# Altium project M3 ICE.PrjPcb
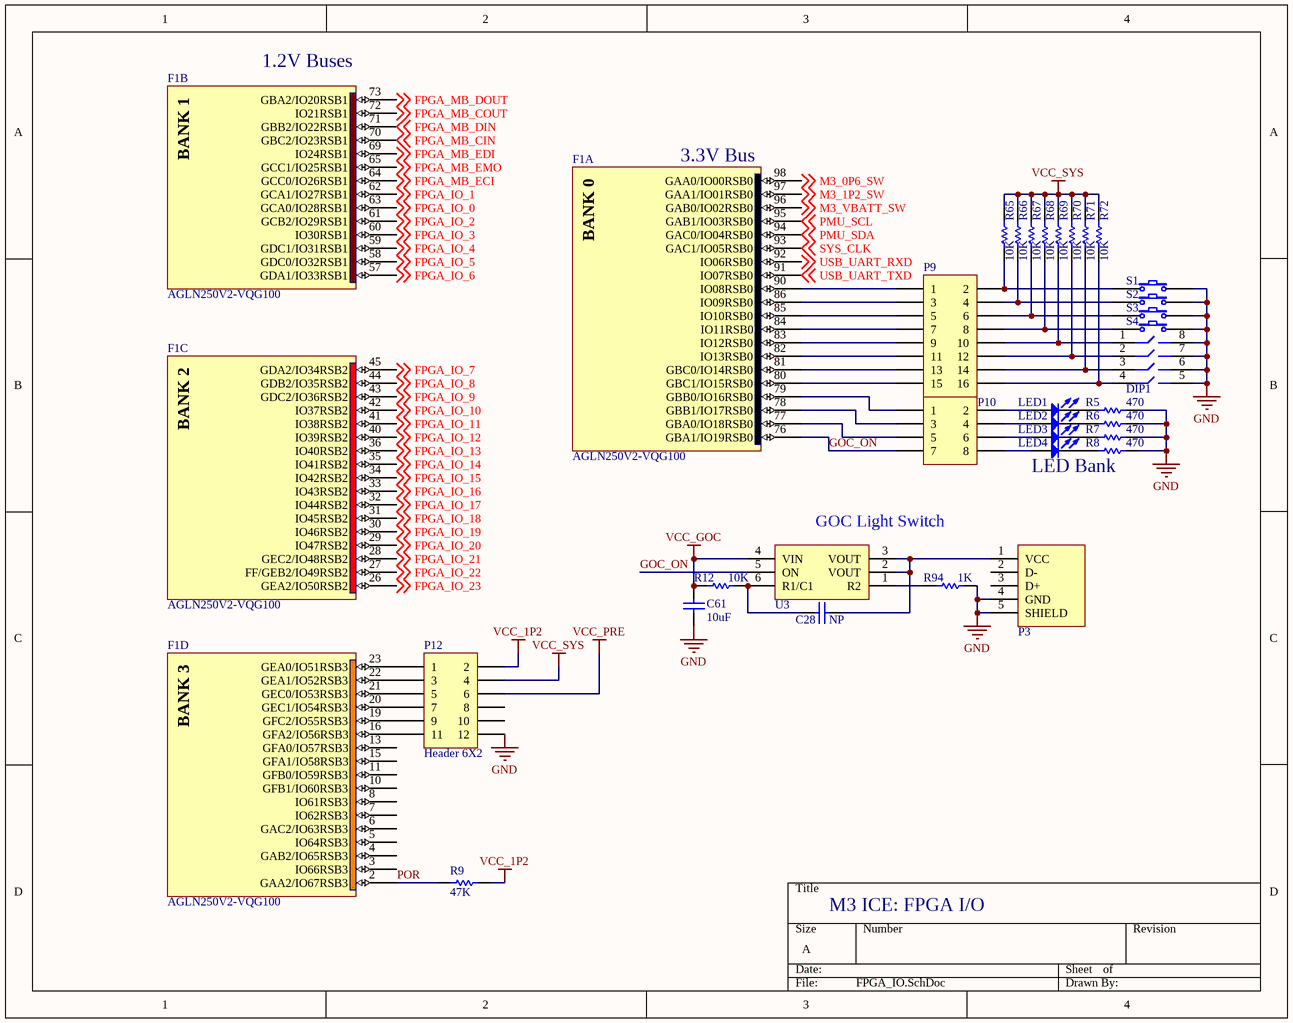
[diagram p0: FPGA_IO.SchDoc]
5 sheets, 223 parts. Net scope: global (net labels, ports and power ports of the same name join across sheets).
Board file: M3 ICE.PcbDoc
Sheets:
  FPGA_IO.SchDoc
  Power.SchDoc
  FPGA_misc.SchDoc
  USB_to_UART.SchDoc
  M3_Chip.SchDoc

## Sheet FPGA_IO.SchDoc
size A

### Parts
C28  value NP  [0402]  (hidden comment: Cap Semi)
C61  value 10uF  [0805]  (hidden comment: Cap Chip)
DIP1  ADE0404  [DIP-8]  (value not drawn)
F1  AGLN250V2-VQG100  [VQ100_N]  (parts A,B,C,D of 8)
LED1  LED 1206  [1206_LED]  (value not drawn)
LED2  LED 1206  [1206_LED]  (value not drawn)
LED3  LED 1206  [1206_LED]  (value not drawn)
LED4  LED 1206  [1206_LED]  (value not drawn)
P3  USB_HORIZONTAL  [USB_HORIZONTAL]  (value not drawn)
P9  Header 8X2  [HDR2X8]  (value not drawn)
P10  Header 4X2  [HDR2X4]  (value not drawn)
P12  Header 6X2  [HDR2X6]
R5  value 470  [0603]  (hidden comment: Res Chip)
R6  value 470  [0603]  (hidden comment: Res Chip)
R7  value 470  [0603]  (hidden comment: Res Chip)
R8  value 470  [0603]  (hidden comment: Res Chip)
R9  value 47K  [0603]  (hidden comment: Res Chip)
R12  value 10K  [0402]  (hidden comment: Res Chip)
R65  value 10K  [0603]  (hidden comment: Res Chip)
R66  value 10K  [0603]  (hidden comment: Res Chip)
R67  value 10K  [0603]  (hidden comment: Res Chip)
R68  value 10K  [0603]  (hidden comment: Res Chip)
R69  value 10K  [0603]  (hidden comment: Res Chip)
R70  value 10K  [0603]  (hidden comment: Res Chip)
R71  value 10K  [0603]  (hidden comment: Res Chip)
R72  value 10K  [0603]  (hidden comment: Res Chip)
R94  value 1K  [0402]  (hidden comment: Res Chip)
S1  EVQ-PAE04M  [EVQPA]  (value not drawn)
S2  EVQ-PAE04M  [EVQPA]  (value not drawn)
S3  EVQ-PAE04M  [EVQPA]  (value not drawn)
S4  EVQ-PAE04M  [EVQPA]  (value not drawn)
U3  FDC6330L  [SUPERSOT-6]  (value not drawn)

### Nets
GND: C61.2 DIP1.5 DIP1.6 DIP1.7 DIP1.8 P3.4(GND) P3.5(SHIELD) P12.12 R5.1 R6.1 R7.1 R8.1 R94.2 S1.2 S2.2 S3.2 S4.2
VCC_1P2: P12.2 R9.2
VCC_GOC: C61.1 R12.1 U3.4(VIN)
VCC_PRE: P12.6
VCC_SYS: P12.4 R65.1 R66.1 R67.1 R68.1 R69.1 R70.1 R71.1 R72.1  [project net VCC_B0]
FPGA_IO_0: F1.63(GCA0/IO28RSB1) ; off-sheet FPGA_IO_0
FPGA_IO_1: F1.62(GCA1/IO27RSB1) ; off-sheet FPGA_IO_1
FPGA_IO_2: F1.61(GCB2/IO29RSB1) ; off-sheet FPGA_IO_2
FPGA_IO_3: F1.60(IO30RSB1) ; off-sheet FPGA_IO_3
FPGA_IO_4: F1.59(GDC1/IO31RSB1) ; off-sheet FPGA_IO_4
FPGA_IO_5: F1.58(GDC0/IO32RSB1) ; off-sheet FPGA_IO_5
FPGA_IO_6: F1.57(GDA1/IO33RSB1) ; off-sheet FPGA_IO_6
FPGA_IO_7: F1.45(GDA2/IO34RSB2) ; off-sheet FPGA_IO_7
FPGA_IO_8: F1.44(GDB2/IO35RSB2) ; off-sheet FPGA_IO_8
FPGA_IO_9: F1.43(GDC2/IO36RSB2) ; off-sheet FPGA_IO_9
FPGA_IO_10: F1.42(IO37RSB2) ; off-sheet FPGA_IO_10
FPGA_IO_11: F1.41(IO38RSB2) ; off-sheet FPGA_IO_11
FPGA_IO_12: F1.40(IO39RSB2) ; off-sheet FPGA_IO_12
FPGA_IO_13: F1.36(IO40RSB2) ; off-sheet FPGA_IO_13
FPGA_IO_14: F1.35(IO41RSB2) ; off-sheet FPGA_IO_14
FPGA_IO_15: F1.34(IO42RSB2) ; off-sheet FPGA_IO_15
FPGA_IO_16: F1.33(IO43RSB2) ; off-sheet FPGA_IO_16
FPGA_IO_17: F1.32(IO44RSB2) ; off-sheet FPGA_IO_17
FPGA_IO_18: F1.31(IO45RSB2) ; off-sheet FPGA_IO_18
FPGA_IO_19: F1.30(IO46RSB2) ; off-sheet FPGA_IO_19
FPGA_IO_20: F1.29(IO47RSB2) ; off-sheet FPGA_IO_20
FPGA_IO_21: F1.28(GEC2/IO48RSB2) ; off-sheet FPGA_IO_21
FPGA_IO_22: F1.27(FF/GEB2/IO49RSB2) ; off-sheet FPGA_IO_22
FPGA_IO_23: F1.26(GEA2/IO50RSB2) ; off-sheet FPGA_IO_23
FPGA_MB_CIN: F1.70(GBC2/IO23RSB1) ; off-sheet FPGA_MB_CIN
FPGA_MB_COUT: F1.72(IO21RSB1) ; off-sheet FPGA_MB_COUT
FPGA_MB_DIN: F1.71(GBB2/IO22RSB1) ; off-sheet FPGA_MB_DIN
FPGA_MB_DOUT: F1.73(GBA2/IO20RSB1) ; off-sheet FPGA_MB_DOUT
FPGA_MB_ECI: F1.64(GCC0/IO26RSB1) ; off-sheet FPGA_MB_ECI
FPGA_MB_EDI: F1.69(IO24RSB1) ; off-sheet FPGA_MB_EDI
FPGA_MB_EMO: F1.65(GCC1/IO25RSB1) ; off-sheet FPGA_MB_EMO
GOC_ON: F1.76(GBA1/IO19RSB0) P10.7 U3.5(ON)
M3_0P6_SW: F1.98(GAA0/IO00RSB0) ; off-sheet M3_0P6_SW
M3_1P2_SW: F1.97(GAA1/IO01RSB0) ; off-sheet M3_1P2_SW
M3_VBATT_SW: F1.96(GAB0/IO02RSB0) ; off-sheet M3_VBATT_SW
PMU_SCL: F1.95(GAB1/IO03RSB0) ; off-sheet PMU_SCL
PMU_SDA: F1.94(GAC0/IO04RSB0) ; off-sheet PMU_SDA
POR: F1.2(GAA2/IO67RSB3) R9.1
SYS_CLK: F1.93(GAC1/IO05RSB0) ; off-sheet SYS_CLK
USB_UART_RXD: F1.92(IO06RSB0) ; off-sheet USB_UART_RXD
USB_UART_TXD: F1.91(IO07RSB0) ; off-sheet USB_UART_TXD
NetC28_1: C28.1 P3.1(VCC) U3.2(VOUT) U3.3(VOUT)
NetC28_2: C28.2 R12.2 U3.6(R1/C1)
NetDIP1_1: DIP1.1 P9.10 R69.2
NetDIP1_2: DIP1.2 P9.12 R70.2
NetDIP1_3: DIP1.3 P9.14 R71.2
NetDIP1_4: DIP1.4 P9.16 R72.2
NetF1_16: F1.16(GFA2/IO56RSB3) P12.11
NetF1_19: F1.19(GFC2/IO55RSB3) P12.9
NetF1_20: F1.20(GEC1/IO54RSB3) P12.7
NetF1_21: F1.21(GEC0/IO53RSB3) P12.5
NetF1_22: F1.22(GEA1/IO52RSB3) P12.3
NetF1_23: F1.23(GEA0/IO51RSB3) P12.1
NetF1_77: F1.77(GBA0/IO18RSB0) P10.5
NetF1_78: F1.78(GBB1/IO17RSB0) P10.3
NetF1_79: F1.79(GBB0/IO16RSB0) P10.1
NetF1_80: F1.80(GBC1/IO15RSB0) P9.15
NetF1_81: F1.81(GBC0/IO14RSB0) P9.13
NetF1_82: F1.82(IO13RSB0) P9.11
NetF1_83: F1.83(IO12RSB0) P9.9
NetF1_84: F1.84(IO11RSB0) P9.7
NetF1_85: F1.85(IO10RSB0) P9.5
NetF1_86: F1.86(IO09RSB0) P9.3
NetF1_90: F1.90(IO08RSB0) P9.1
NetLED1_1: LED1.1(A) P10.2
NetLED1_2: LED1.2(K) R5.2
NetLED2_1: LED2.1(A) P10.4
NetLED2_2: LED2.2(K) R6.2
NetLED3_1: LED3.1(A) P10.6
NetLED3_2: LED3.2(K) R7.2
NetLED4_1: LED4.1(A) P10.8
NetLED4_2: LED4.2(K) R8.2
NetP9_2: P9.2 R65.2 S1.1
NetP9_4: P9.4 R66.2 S2.1
NetP9_6: P9.6 R67.2 S3.1
NetP9_8: P9.8 R68.2 S4.1
NetR94_1: R94.1 U3.1(R2)

Not connected (* = marked no-connect by the designer): F1 3(IO66RSB3) 4(GAB2/IO65RSB3) 5(IO64RSB3) 6(GAC2/IO63RSB3) 7(IO62RSB3) 8(IO61RSB3) 10(GFB1/IO60RSB3) 11(GFB0/IO59RSB3) 13(GFA0/IO57RSB3) 15(GFA1/IO58RSB3); P3 2(D-) 3(D+); P12 8 10

### Notes on the sheet
- (near F1) 1.2V Buses
- (near F1) 3.3V Bus
- LED Bank
- (near U3) GOC Light Switch
- M3 ICE: FPGA I/O
- (in symbol AGLN250V2-VQG100, part A) BANK 0
- (in symbol AGLN250V2-VQG100, part B) BANK 1
- (in symbol AGLN250V2-VQG100, part C) BANK 2
- (in symbol AGLN250V2-VQG100, part D) BANK 3

### Library data of the parts
C28 = Cap Semi: Capacitor (Semiconductor SIM Model); Published: 8-Jun-2000; LatestRevisionDate: 29-May-2009; LatestRevisionNote: IPC-7351 Footprint Added.; PackageReference: C1206; Publisher: Altium Limited; PackageDescription: Chip Capacitor
C61 = Cap Chip: Capacitor (Semiconductor SIM Model); DistPartNo: 445-6857-1-ND; ManPartNo: C2012X7R1A106K; Published: 8-Jun-2000; LatestRevisionDate: 29-May-2009; LatestRevisionNote: IPC-7351 Footprint Added.; PackageReference: C1206; Publisher: Altium Limited; PackageDescription: Chip Capacitor
DIP1 = ADE0404: 4-DIP Switch; DistPartNo: 450-1364-ND; PackageReference: DIP-8; ManPartNo: ADE0404
F1 = AGLN250V2-VQG100: IGLOO nano Low-Power Flash 1.2 to 1.5V FPGA with Flash*Freeze, 68 User IOs, 250K System Gates, 1Kbit Flash ROM, 100-Pin TQFP, Commercial Grade, Pb-Free; DistPartNo: 1100-1134-ND; Published: 29-May-2009; DatasheetVersion: Feb-2009; PackageVersion: v11.0, Feb-2009; PackageReference: VQ100; Publisher: Altium Limited; PackageDescription: 100-Pin Plastic Quad Flat Pack (VQ100); Code_JEDEC: MS-026-AED; ComponentLink1Description: Manufacturer Link; ComponentLink1URL: http://www.actel.com/products/igloonano/default.aspx; ComponentLink2Description: Datasheet; ComponentLink2URL: http://www.actel.com/documents/IGLOO_nano_DS.pdf; ManPartNo: AGLN250V2-VQG100
LED1-LED4 = LED 1206: DistPartNo: 160-1169-1-ND; ManPartNo: LTST-C150GKT
P3 = USB_HORIZONTAL: DistPartNo: A31726-ND; ManPartNo: 292303-1
P9 = Header 8X2: Header, 8-Pin, Dual row; LatestRevisionDate: 17-Jul-2002; LatestRevisionNote: Re-released for DXP Platform.; Publisher: Altium Limited
P10 = Header 4X2: Header, 4-Pin, Dual row; LatestRevisionDate: 17-Jul-2002; LatestRevisionNote: Re-released for DXP Platform.; Publisher: Altium Limited
P12 = Header 6X2: Header, 6-Pin, Dual row; LatestRevisionDate: 17-Jul-2002; LatestRevisionNote: Re-released for DXP Platform.; Publisher: Altium Limited
R5-R8 = Res Chip: Semiconductor Resistor; DistPartNo: P470GCT-ND; ManPartNo: ERJ-3GEYJ471V; Published: 8-Jun-2000; LatestRevisionDate: 17-Jul-2002; LatestRevisionNote: Re-released for DXP Platform.; PackageReference: AXIAL-0.5; Publisher: Altium Limited; PackageDescription: Axial Device, Thru-Hole; 2 Leads; 0.5 in Pin Spacing
R9 = Res Chip: Semiconductor Resistor; DistPartNo: P47KGCT-ND; ManPartNo: ERJ-3GEYJ103V; Published: 8-Jun-2000; LatestRevisionDate: 17-Jul-2002; LatestRevisionNote: Re-released for DXP Platform.; PackageReference: AXIAL-0.5; Publisher: Altium Limited; PackageDescription: Axial Device, Thru-Hole; 2 Leads; 0.5 in Pin Spacing
R12 = Res Chip: Semiconductor Resistor; ManPartNo: ERJ-2RKF1002X; DistPartNo: P10.0KLCT-ND; Published: 8-Jun-2000; LatestRevisionDate: 17-Jul-2002; LatestRevisionNote: Re-released for DXP Platform.; PackageReference: AXIAL-0.5; Publisher: Altium Limited; PackageDescription: Axial Device, Thru-Hole; 2 Leads; 0.5 in Pin Spacing
R65-R72 = Res Chip: Semiconductor Resistor; DistPartNo: P10KGCT-ND; ManPartNo: ERJ-3GEYJ103V; Published: 8-Jun-2000; LatestRevisionDate: 17-Jul-2002; LatestRevisionNote: Re-released for DXP Platform.; PackageReference: AXIAL-0.5; Publisher: Altium Limited; PackageDescription: Axial Device, Thru-Hole; 2 Leads; 0.5 in Pin Spacing
R94 = Res Chip: Semiconductor Resistor; ManPartNo: ERJ-2RKF1001X; DistPartNo: P1.00KLCT-ND; Published: 8-Jun-2000; LatestRevisionDate: 17-Jul-2002; LatestRevisionNote: Re-released for DXP Platform.; PackageReference: AXIAL-0.5; Publisher: Altium Limited; PackageDescription: Axial Device, Thru-Hole; 2 Leads; 0.5 in Pin Spacing
S1-S4 = EVQ-PAE04M: Switch Push; DistPartNo: P8008S-ND; ManPartNo: EVQ-PAE04M
U3 = FDC6330L: HS Switch; DistPartNo: FDC6330LCT-ND; ManPartNo: FDC6330L

## Sheet Power.SchDoc
size A
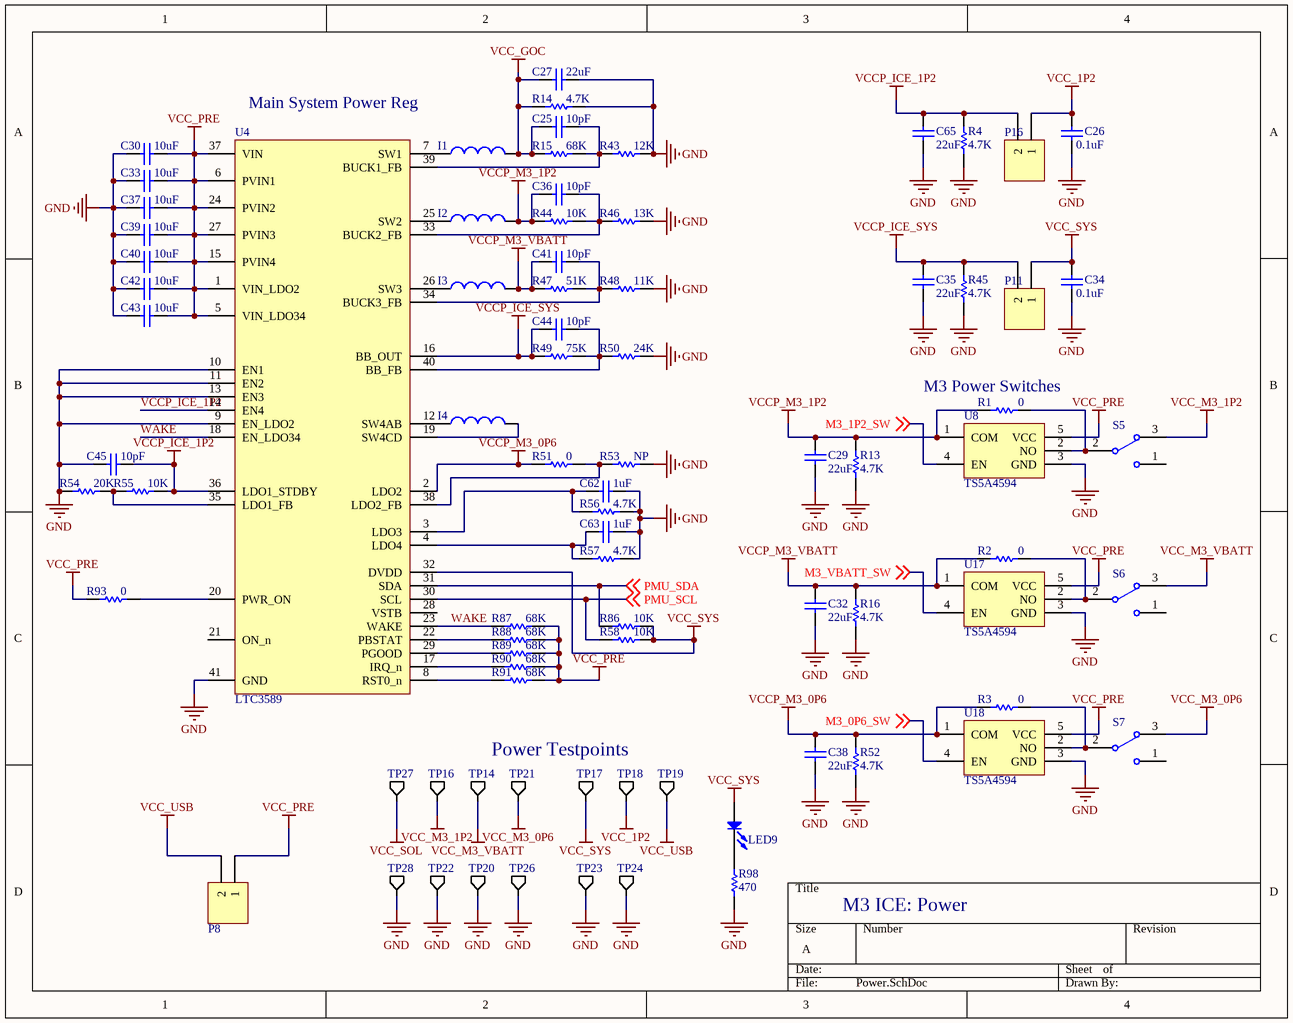
[diagram p1: Power.SchDoc]

### Parts
C25  value 10pF  [0402]  (hidden comment: Cap Semi)
C26  value 0.1uF  [1608[0603]]  (hidden comment: Cap Semi)
C27  value 22uF  [0805]  (hidden comment: Cap Chip)
C29  value 22uF  [0805]  (hidden comment: Cap Chip)
C30  value 10uF  [0805]  (hidden comment: Cap Chip)
C32  value 22uF  [0805]  (hidden comment: Cap Chip)
C33  value 10uF  [0805]  (hidden comment: Cap Chip)
C34  value 0.1uF  [1608[0603]]  (hidden comment: Cap Semi)
C35  value 22uF  [0805]  (hidden comment: Cap Chip)
C36  value 10pF  [0402]  (hidden comment: Cap Semi)
C37  value 10uF  [0805]  (hidden comment: Cap Chip)
C38  value 22uF  [0805]  (hidden comment: Cap Chip)
C39  value 10uF  [0805]  (hidden comment: Cap Chip)
C40  value 10uF  [0805]  (hidden comment: Cap Chip)
C41  value 10pF  [0402]  (hidden comment: Cap Semi)
C42  value 10uF  [0805]  (hidden comment: Cap Chip)
C43  value 10uF  [0805]  (hidden comment: Cap Chip)
C44  value 10pF  [0402]  (hidden comment: Cap Semi)
C45  value 10pF  [0402]  (hidden comment: Cap Semi)
C62  value 1uF  [0402]  (hidden comment: Cap Semi)
C63  value 1uF  [0402]  (hidden comment: Cap Semi)
C65  value 22uF  [0805]  (hidden comment: Cap Chip)
I1  NR5040T1R5N  [INDUCTOR_.118x.142mm]  (value not drawn)
I2  NR5040T1R5N  [INDUCTOR_.118x.142mm]  (value not drawn)
I3  NR5040T1R5N  [INDUCTOR_.118x.142mm]  (value not drawn)
I4  NR5040T1R5N  [INDUCTOR_.118x.142mm]  (value not drawn)
LED9  LED 1206  [1206_LED]  (value not drawn)
P8  Header 2  [HDR1X2]  (value not drawn)
P11  Header 2  [HDR1X2]  (value not drawn)
P16  Header 2  [HDR1X2]  (value not drawn)
R1  value 0  [0603]  (hidden comment: Res Chip)
R2  value 0  [0603]  (hidden comment: Res Chip)
R3  value 0  [0603]  (hidden comment: Res Chip)
R4  value 4.7K  [0603]  (hidden comment: Res Chip)
R13  value 4.7K  [0603]  (hidden comment: Res Chip)
R14  value 4.7K  [0603]  (hidden comment: Res Chip)
R15  value 68K  [0402]  (hidden comment: Res Chip)
R16  value 4.7K  [0603]  (hidden comment: Res Chip)
R43  value 12K  [0402]  (hidden comment: Res Chip)
R44  value 10K  [0402]  (hidden comment: Res Chip)
R45  value 4.7K  [0603]  (hidden comment: Res Chip)
R46  value 13K  [0402]  (hidden comment: Res Chip)
R47  value 51K  [0402]  (hidden comment: Res Chip)
R48  value 11K  [0402]  (hidden comment: Res Chip)
R49  value 75K  [0402]  (hidden comment: Res Chip)
R50  value 24K  [0402]  (hidden comment: Res Chip)
R51  value 0  [0402]  (hidden comment: Res Chip)
R52  value 4.7K  [0603]  (hidden comment: Res Chip)
R53  value NP  [0402]  (hidden comment: Res Chip)
R54  value 20K  [0402]  (hidden comment: Res Chip)
R55  value 10K  [0402]  (hidden comment: Res Chip)
R56  value 4.7K  [0402]  (hidden comment: Res Chip)
R57  value 4.7K  [0402]  (hidden comment: Res Chip)
R58  value 10K  [0402]  (hidden comment: Res Chip)
R86  value 10K  [0402]  (hidden comment: Res Chip)
R87  value 68K  [0402]  (hidden comment: Res Chip)
R88  value 68K  [0402]  (hidden comment: Res Chip)
R89  value 68K  [0402]  (hidden comment: Res Chip)
R90  value 68K  [0402]  (hidden comment: Res Chip)
R91  value 68K  [0402]  (hidden comment: Res Chip)
R93  value 0  [0402]  (hidden comment: Res Chip)
R98  value 470  [0603]  (hidden comment: Res Chip)
S5  OS102011MS2QN1  [SPDT_SW2]  (value not drawn)
S6  OS102011MS2QN1  [SPDT_SW2]  (value not drawn)
S7  OS102011MS2QN1  [SPDT_SW2]  (value not drawn)
TP14  TP  [TP]  (value not drawn)
TP16  TP  [TP]  (value not drawn)
TP17  TP  [TP]  (value not drawn)
TP18  TP  [TP]  (value not drawn)
TP19  TP  [TP]  (value not drawn)
TP20  TP  [TP]  (value not drawn)
TP21  TP  [TP]  (value not drawn)
TP22  TP  [TP]  (value not drawn)
TP23  TP  [TP]  (value not drawn)
TP24  TP  [TP]  (value not drawn)
TP26  TP  [TP]  (value not drawn)
TP27  TP  [TP]  (value not drawn)
TP28  TP  [TP]  (value not drawn)
U4  LTC3589  [QFN-40]
U8  TS5A4594  [SOT25]
U17  TS5A4594  [SOT25]
U18  TS5A4594  [SOT25]

### Nets
GND: C26.1 C27.1 C29.1 C30.2 C32.1 C33.2 C34.1 C35.1 C37.2 C38.1 C39.2 C40.2 C42.2 C43.2 C45.2 C62.1 C63.1 C65.2 R4.2 R13.1 R14.1 R16.1 R43.2 R45.1 R46.2 R48.2 R50.2 R52.1 R53.2 R54.1 R56.2 R57.2 R98.1 TP20.1(A) TP22.1(A) TP23.1(A) TP24.1(A) TP26.1(A) TP28.1(A) U4.9(EN_LDO2) U4.10(EN1) U4.11(EN2) U4.13(EN3) U4.41(GND) U8.3(GND) U17.3(GND) U18.3(GND)
VCC_1P2: C26.2 P16.1 TP18.1(A)
VCC_GOC: C25.2 C27.2 I1.2 R14.2 R15.1
VCC_M3_0P6: S7.3 TP21.1(A)
VCC_M3_1P2: S5.3 TP16.1(A)
VCC_M3_VBATT: S6.3 TP14.1(A)
VCC_PRE: C30.1 C33.1 C37.1 C39.1 C40.1 C42.1 C43.1 P8.1 R87.2 R88.2 R89.2 R90.2 R91.2 R93.1 U4.1(VIN_LDO2) U4.5(VIN_LDO34) U4.6(PVIN1) U4.15(PVIN4) U4.24(PVIN2) U4.27(PVIN3) U4.37(VIN) U8.5(VCC) U17.5(VCC) U18.5(VCC)
VCC_SOL: TP27.1(A)
VCC_SYS: C34.2 LED9.1(A) P11.1 R58.2 R86.2 TP17.1(A) U4.32(DVDD)  [project net VCC_B0]
VCC_USB: P8.2 TP19.1(A)
VCCP_ICE_1P2: C45.1 C65.1 P16.2 R4.1 R55.2 U4.14(EN4) U4.36(LDO1_STDBY)
VCCP_ICE_SYS: C35.2 C44.2 P11.2 R45.2 R49.1 U4.16(BB_OUT)
VCCP_M3_0P6: C38.2 R3.2 R51.1 R52.2 U4.2(LDO2) U18.1(COM)
VCCP_M3_1P2: C29.2 C36.2 I2.2 R1.2 R13.2 R44.1 U8.1(COM)
VCCP_M3_VBATT: C32.2 C41.2 I3.2 R2.2 R16.2 R47.1 U17.1(COM)
M3_0P6_SW: U18.4(EN) ; off-sheet M3_0P6_SW
M3_1P2_SW: U8.4(EN) ; off-sheet M3_1P2_SW
M3_VBATT_SW: U17.4(EN) ; off-sheet M3_VBATT_SW
PMU_SCL: R58.1 U4.30(SCL) ; off-sheet PMU_SCL
PMU_SDA: R86.1 U4.31(SDA) ; off-sheet PMU_SDA
WAKE: R87.1 U4.18(EN_LDO34) U4.23(WAKE)
NetC25_1: C25.1 R15.2 R43.1 U4.39(BUCK1_FB)
NetC36_1: C36.1 R44.2 R46.1 U4.33(BUCK2_FB)
NetC41_1: C41.1 R47.2 R48.1 U4.34(BUCK3_FB)
NetC44_1: C44.1 R49.2 R50.1 U4.40(BB_FB)
NetC62_2: C62.2 R56.1 U4.3(LDO3)
NetC63_2: C63.2 R57.1 U4.4(LDO4)
NetI1_1: I1.1 U4.7(SW1)
NetI2_1: I2.1 U4.25(SW2)
NetI3_1: I3.1 U4.26(SW3)
NetI4_1: I4.1 U4.12(SW4AB)
NetI4_2: I4.2 U4.19(SW4CD)
NetLED9_2: LED9.2(K) R98.2
NetR1_1: R1.1 S5.2 U8.2(NO)
NetR2_1: R2.1 S6.2 U17.2(NO)
NetR3_1: R3.1 S7.2 U18.2(NO)
NetR51_2: R51.2 R53.1 U4.38(LDO2_FB)
NetR54_2: R54.2 R55.1 U4.35(LDO1_FB)
NetR88_1: R88.1 U4.22(PBSTAT)
NetR89_1: R89.1 U4.29(PGOOD)
NetR90_1: R90.1 U4.17(IRQ_n)
NetR91_1: R91.1 U4.8(RST0_n)
NetR93_2: R93.2 U4.20(PWR_ON)

Not connected (* = marked no-connect by the designer): S5 1; S6 1; S7 1; U4 21(ON_n) 28(VSTB)

### Notes on the sheet
- Main System Power Reg
- (near R1) M3 Power Switches
- Power Testpoints
- M3 ICE: Power

### Library data of the parts
C25 C36 C41 C44 C45 = Cap Semi: Capacitor (Semiconductor SIM Model); DistPartNo: 445-1235-1-ND; ManPartNo: C1005C0G1H100D; Published: 8-Jun-2000; LatestRevisionDate: 29-May-2009; LatestRevisionNote: IPC-7351 Footprint Added.; PackageReference: C1206; Publisher: Altium Limited; PackageDescription: Chip Capacitor
C26 C34 = Cap Semi: Capacitor (Semiconductor SIM Model); DistPartNo: 1276-1005-1-ND; ManPartNo: CL10B104KO8NNNC; Published: 8-Jun-2000; LatestRevisionDate: 29-May-2009; LatestRevisionNote: IPC-7351 Footprint Added.; PackageReference: C1206; Publisher: Altium Limited; PackageDescription: Chip Capacitor
C27 C29 C32 C35 C38 C65 = Cap Chip: Capacitor (Semiconductor SIM Model); DistPartNo: 587-2782-1-ND; ManPartNo: LMK316AB7226ML-TR; Published: 8-Jun-2000; LatestRevisionDate: 29-May-2009; LatestRevisionNote: IPC-7351 Footprint Added.; PackageReference: C1206; Publisher: Altium Limited; PackageDescription: Chip Capacitor
C30 C33 C37 C39 C40 C42 C43 = Cap Chip: as C61 on sheet FPGA_IO; Published: 8-Jun-2000; LatestRevisionDate: 29-May-2009; LatestRevisionNote: IPC-7351 Footprint Added.; PackageReference: C1206; Publisher: Altium Limited; PackageDescription: Chip Capacitor
C62 C63 = Cap Semi: Capacitor (Semiconductor SIM Model); DistPartNo: 445-4991-1-ND; ManPartNo: C1005X5R1A105M; Published: 8-Jun-2000; LatestRevisionDate: 29-May-2009; LatestRevisionNote: IPC-7351 Footprint Added.; PackageReference: C1206; Publisher: Altium Limited; PackageDescription: Chip Capacitor
I1-I4 = IHLP1212: DistPartNo: 541-1327-1-ND; ManPartNo: IHLP1212AEER1R0M11
LED9 = LED 1206: as LED1 on sheet FPGA_IO
P8 P11 P16 = Header 2: Header, 2-Pin; LatestRevisionDate: 17-Jul-2002; LatestRevisionNote: Re-released for DXP Platform.; Publisher: Altium Limited
R1-R3 = Res Chip: Semiconductor Resistor; DistPartNo: P0.0GCT-ND; ManPartNo: ERJ-3GEY0R00V; Published: 8-Jun-2000; LatestRevisionDate: 17-Jul-2002; LatestRevisionNote: Re-released for DXP Platform.; PackageReference: AXIAL-0.5; Publisher: Altium Limited; PackageDescription: Axial Device, Thru-Hole; 2 Leads; 0.5 in Pin Spacing
R4 R13 R14 R16 R45 R52 = Res Chip: Semiconductor Resistor; DistPartNo: P4.7KGCT-ND; ManPartNo: ERJ-3GEYJ472V; Published: 8-Jun-2000; LatestRevisionDate: 17-Jul-2002; LatestRevisionNote: Re-released for DXP Platform.; PackageReference: AXIAL-0.5; Publisher: Altium Limited; PackageDescription: Axial Device, Thru-Hole; 2 Leads; 0.5 in Pin Spacing
R15 R87-R91 = Res Chip: Semiconductor Resistor; DistPartNo: P68.0KLCT-ND; ManPartNo: ERJ-2RKF6802X; Published: 8-Jun-2000; LatestRevisionDate: 17-Jul-2002; LatestRevisionNote: Re-released for DXP Platform.; PackageReference: AXIAL-0.5; Publisher: Altium Limited; PackageDescription: Axial Device, Thru-Hole; 2 Leads; 0.5 in Pin Spacing
R43 = Res Chip: Semiconductor Resistor; DistPartNo: P12.0KLCT-ND; ManPartNo: ERJ-2RKF1202X; Published: 8-Jun-2000; LatestRevisionDate: 17-Jul-2002; LatestRevisionNote: Re-released for DXP Platform.; PackageReference: AXIAL-0.5; Publisher: Altium Limited; PackageDescription: Axial Device, Thru-Hole; 2 Leads; 0.5 in Pin Spacing
R44 R55 R58 R86 = Res Chip: Semiconductor Resistor; DistPartNo: P10.0KLCT-ND; ManPartNo: ERJ-2RKF1002X; Published: 8-Jun-2000; LatestRevisionDate: 17-Jul-2002; LatestRevisionNote: Re-released for DXP Platform.; PackageReference: AXIAL-0.5; Publisher: Altium Limited; PackageDescription: Axial Device, Thru-Hole; 2 Leads; 0.5 in Pin Spacing
R46 = Res Chip: Semiconductor Resistor; DistPartNo: 311-13.0KLRCT-ND; ManPartNo: RC0402FR-0713KL; Published: 8-Jun-2000; LatestRevisionDate: 17-Jul-2002; LatestRevisionNote: Re-released for DXP Platform.; PackageReference: AXIAL-0.5; Publisher: Altium Limited; PackageDescription: Axial Device, Thru-Hole; 2 Leads; 0.5 in Pin Spacing
R47 = Res Chip: Semiconductor Resistor; DistPartNo: P51.0KLCT-ND; ManPartNo: ERJ-2RKF5102X; Published: 8-Jun-2000; LatestRevisionDate: 17-Jul-2002; LatestRevisionNote: Re-released for DXP Platform.; PackageReference: AXIAL-0.5; Publisher: Altium Limited; PackageDescription: Axial Device, Thru-Hole; 2 Leads; 0.5 in Pin Spacing
R48 = Res Chip: Semiconductor Resistor; DistPartNo: P11.0KLCT-ND; ManPartNo: ERJ-2RKF1102X; Published: 8-Jun-2000; LatestRevisionDate: 17-Jul-2002; LatestRevisionNote: Re-released for DXP Platform.; PackageReference: AXIAL-0.5; Publisher: Altium Limited; PackageDescription: Axial Device, Thru-Hole; 2 Leads; 0.5 in Pin Spacing
R49 = Res Chip: Semiconductor Resistor; DistPartNo: P75.0KLCT-ND; ManPartNo: ERJ-2RKF7502X; Published: 8-Jun-2000; LatestRevisionDate: 17-Jul-2002; LatestRevisionNote: Re-released for DXP Platform.; PackageReference: AXIAL-0.5; Publisher: Altium Limited; PackageDescription: Axial Device, Thru-Hole; 2 Leads; 0.5 in Pin Spacing
R50 = Res Chip: Semiconductor Resistor; DistPartNo: RMCF0402FT24K0CT-ND; ManPartNo: RMCF0402FT24K0; Published: 8-Jun-2000; LatestRevisionDate: 17-Jul-2002; LatestRevisionNote: Re-released for DXP Platform.; PackageReference: AXIAL-0.5; Publisher: Altium Limited; PackageDescription: Axial Device, Thru-Hole; 2 Leads; 0.5 in Pin Spacing
R51 R93 = Res Chip: Semiconductor Resistor; DistPartNo: P0.0JCT-ND; ManPartNo: ERJ-2GE0R00X; Published: 8-Jun-2000; LatestRevisionDate: 17-Jul-2002; LatestRevisionNote: Re-released for DXP Platform.; PackageReference: AXIAL-0.5; Publisher: Altium Limited; PackageDescription: Axial Device, Thru-Hole; 2 Leads; 0.5 in Pin Spacing
R53 = Res Chip: Semiconductor Resistor; Published: 8-Jun-2000; LatestRevisionDate: 17-Jul-2002; LatestRevisionNote: Re-released for DXP Platform.; PackageReference: AXIAL-0.5; Publisher: Altium Limited; PackageDescription: Axial Device, Thru-Hole; 2 Leads; 0.5 in Pin Spacing
R54 = Res Chip: Semiconductor Resistor; DistPartNo: P20.0KLCT-ND; ManPartNo: ERJ-2RKF2002X; Published: 8-Jun-2000; LatestRevisionDate: 17-Jul-2002; LatestRevisionNote: Re-released for DXP Platform.; PackageReference: AXIAL-0.5; Publisher: Altium Limited; PackageDescription: Axial Device, Thru-Hole; 2 Leads; 0.5 in Pin Spacing
R56 R57 = Res Chip: Semiconductor Resistor; DistPartNo: P4.70KLCT-ND; ManPartNo: ERJ-2RKF4701X; Published: 8-Jun-2000; LatestRevisionDate: 17-Jul-2002; LatestRevisionNote: Re-released for DXP Platform.; PackageReference: AXIAL-0.5; Publisher: Altium Limited; PackageDescription: Axial Device, Thru-Hole; 2 Leads; 0.5 in Pin Spacing
R98 = Res Chip: as R5 on sheet FPGA_IO; Published: 8-Jun-2000; LatestRevisionDate: 17-Jul-2002; LatestRevisionNote: Re-released for DXP Platform.; PackageReference: AXIAL-0.5; Publisher: Altium Limited; PackageDescription: Axial Device, Thru-Hole; 2 Leads; 0.5 in Pin Spacing
S5-S7 = OS102011MS2QN1: SPDT Slide Switch; DistPartNo: CKN9565-ND; ManPartNo: OS102011MS2QN1
U4 = LTC3589: DistPartNo: LTC3589EUJ-2#PBF-ND; ManPartNo: LTC3589EUJ-2#PBF
U8 U17 U18 = TS5A4594: SPST Analog Switch; DistPartNo: 296-17705-1-ND; ManPartNo: TS5A4594DBVR

## Sheet FPGA_misc.SchDoc
size A
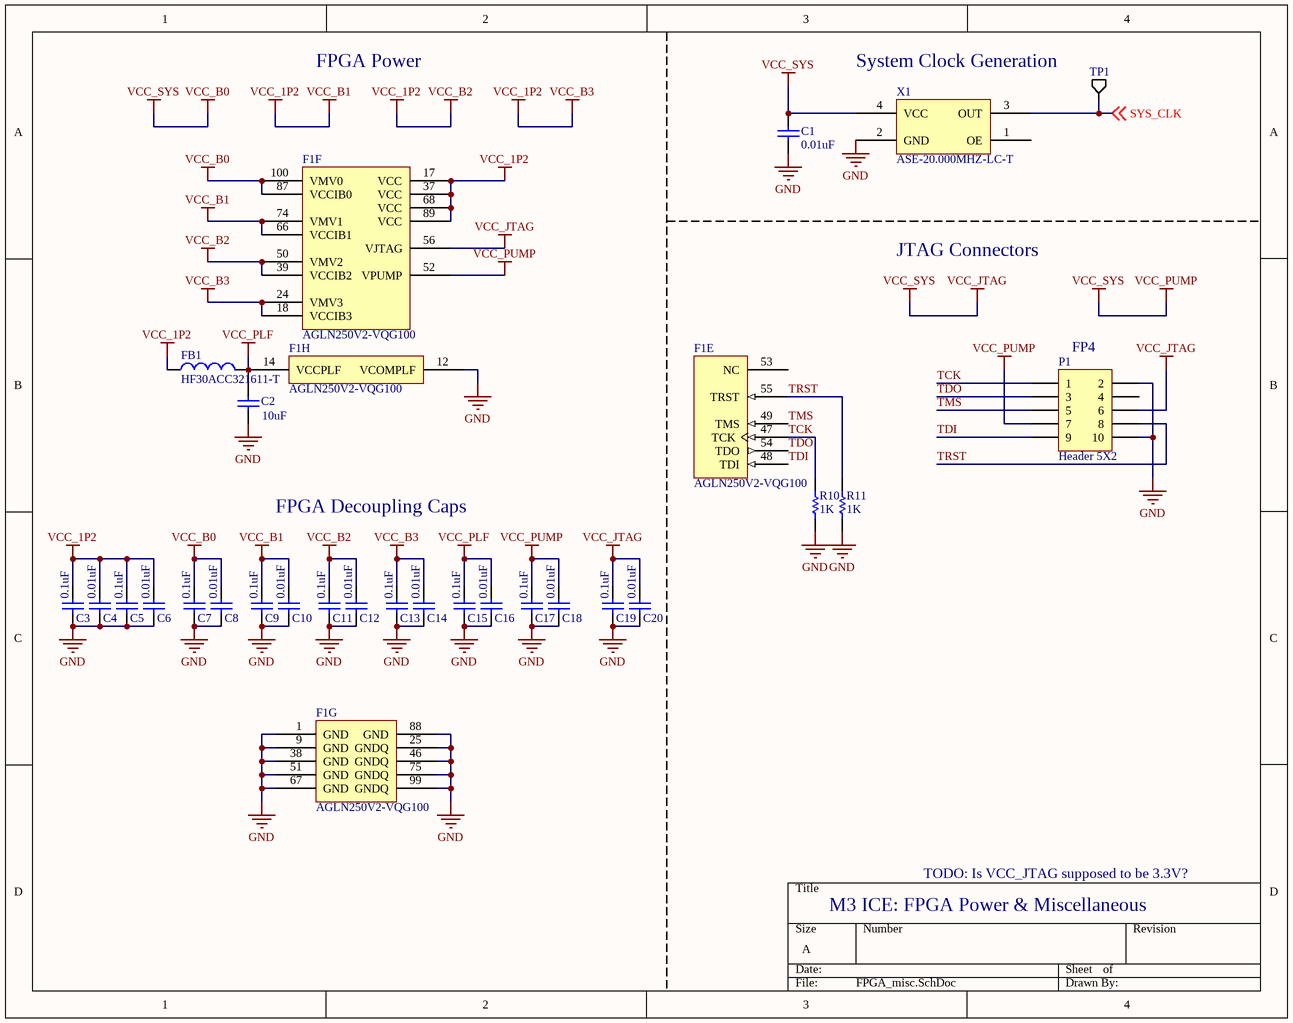
[diagram p2: FPGA_misc.SchDoc]

### Parts
C1  value 0.01uF  [1608[0603]]  (hidden comment: Cap Semi)
C2  value 10uF  [0805]  (hidden comment: Cap Chip)
C3  value 0.1uF  [1608[0603]]  (hidden comment: Cap Semi)
C4  value 0.01uF  [1608[0603]]  (hidden comment: Cap Semi)
C5  value 0.1uF  [1608[0603]]  (hidden comment: Cap Semi)
C6  value 0.01uF  [1608[0603]]  (hidden comment: Cap Semi)
C7  value 0.1uF  [1608[0603]]  (hidden comment: Cap Semi)
C8  value 0.01uF  [1608[0603]]  (hidden comment: Cap Semi)
C9  value 0.1uF  [1608[0603]]  (hidden comment: Cap Semi)
C10  value 0.01uF  [1608[0603]]  (hidden comment: Cap Semi)
C11  value 0.1uF  [1608[0603]]  (hidden comment: Cap Semi)
C12  value 0.01uF  [1608[0603]]  (hidden comment: Cap Semi)
C13  value 0.1uF  [1608[0603]]  (hidden comment: Cap Semi)
C14  value 0.01uF  [1608[0603]]  (hidden comment: Cap Semi)
C15  value 0.1uF  [1608[0603]]  (hidden comment: Cap Semi)
C16  value 0.01uF  [1608[0603]]  (hidden comment: Cap Semi)
C17  value 0.1uF  [1608[0603]]  (hidden comment: Cap Semi)
C18  value 0.01uF  [1608[0603]]  (hidden comment: Cap Semi)
C19  value 0.1uF  [1608[0603]]  (hidden comment: Cap Semi)
C20  value 0.01uF  [1608[0603]]  (hidden comment: Cap Semi)
F1  AGLN250V2-VQG100  [VQ100_N]  (parts E,F,G,H of 8)
FB1  HF30ACC321611-T  [Ferrite_Bead_3.2mm_1.6mm]
P1  Header 5X2  [HDR2X5]
R10  value 1K  [0603]  (hidden comment: Res Chip)
R11  value 1K  [0603]  (hidden comment: Res Chip)
TP1  TP  [TP]  (value not drawn)
X1  ASE-20.000MHZ-LC-T  [CRYSTAL_3.2mm_2.5mm]

### Nets
GND: C1.1 C2.1 C3.1 C4.1 C5.1 C6.1 C7.1 C8.1 C9.1 C10.1 C11.1 C12.1 C13.1 C14.1 C15.1 C16.1 C17.1 C18.1 C19.1 C20.1 F1.1(GND) F1.9(GND) F1.12(VCOMPLF) F1.25(GNDQ) F1.38(GND) F1.46(GNDQ) F1.51(GND) F1.67(GND) F1.75(GNDQ) F1.88(GND) F1.99(GNDQ) P1.2 P1.10 R10.2 R11.2 X1.2(GND)
VCC_1P2: C3.2 C4.2 C5.2 C6.2 C9.2 C10.2 C11.2 C12.2 C13.2 C14.2 F1.17(VCC) F1.18(VCCIB3) F1.24(VMV3) F1.37(VCC) F1.39(VCCIB2) F1.50(VMV2) F1.66(VCCIB1) F1.68(VCC) F1.74(VMV1) F1.89(VCC) FB1.1  [also labelled VCC_B1, VCC_B2, VCC_B3]
VCC_B0: C1.2 C7.2 C8.2 C17.2 C18.2 C19.2 C20.2 F1.52(VPUMP) F1.56(VJTAG) F1.87(VCCIB0) F1.100(VMV0) P1.6 P1.7 X1.4(VCC)  [also labelled VCC_JTAG, VCC_PUMP, VCC_SYS]
VCC_PLF: C2.2 C15.2 C16.2 F1.14(VCCPLF) FB1.2
SYS_CLK: TP1.1(A) X1.3(OUT) ; off-sheet SYS_CLK
TCK: F1.47(TCK) P1.1 R10.1
TDI: F1.48(TDI) P1.9
TDO: F1.54(TDO) P1.3
TMS: F1.49(TMS) P1.5
TRST: F1.55(TRST) P1.8 R11.1

Not connected (* = marked no-connect by the designer): F1 53(NC); P1 4; X1 1(OE)

### Notes on the sheet
- FPGA Power
- System Clock Generation
- JTAG Connectors
- (near P1) FP4
- FPGA Decoupling Caps
- M3 ICE: FPGA Power & Miscellaneous
- TODO: Is VCC_JTAG supposed to be 3.3V?

### Library data of the parts
C1 C4 C6 C8 C10 C12 C14 C16 C18 C20 = Cap Semi: Capacitor (Semiconductor SIM Model); DistPartNo: 445-1311-1-ND; ManPartNo: C1608X7R1H103K; Published: 8-Jun-2000; LatestRevisionDate: 29-May-2009; LatestRevisionNote: IPC-7351 Footprint Added.; PackageReference: C1206; Publisher: Altium Limited; PackageDescription: Chip Capacitor
C2 = Cap Chip: as C61 on sheet FPGA_IO; Published: 8-Jun-2000; LatestRevisionDate: 29-May-2009; LatestRevisionNote: IPC-7351 Footprint Added.; PackageReference: C1206; Publisher: Altium Limited; PackageDescription: Chip Capacitor
C3 C5 C7 C9 C11 C13 C15 C17 C19 = Cap Semi: as C26 on sheet Power; Published: 8-Jun-2000; LatestRevisionDate: 29-May-2009; LatestRevisionNote: IPC-7351 Footprint Added.; PackageReference: C1206; Publisher: Altium Limited; PackageDescription: Chip Capacitor
F1 = AGLN250V2-VQG100: as F1 on sheet FPGA_IO; Published: 29-May-2009; DatasheetVersion: Feb-2009; PackageVersion: v11.0, Feb-2009; PackageReference: VQ100; Publisher: Altium Limited; PackageDescription: 100-Pin Plastic Quad Flat Pack (VQ100); Code_JEDEC: MS-026-AED; ComponentLink1Description: Manufacturer Link; ComponentLink1URL: http://www.actel.com/products/igloonano/default.aspx; ComponentLink2Description: Datasheet; ComponentLink2URL: http://www.actel.com/documents/IGLOO_nano_DS.pdf; ManPartNo: AGLN250V2-VQG100
FB1 = Ferrite Bead HF30ACC321611-T: DistPartNo: 445-6165-1-ND; ManPartNo: HF30ACC321611-T
P1 = Header 5X2: Header, 5-Pin, Dual row; LatestRevisionDate: 17-Jul-2002; LatestRevisionNote: Re-released for DXP Platform.; Publisher: Altium Limited
R10 R11 = Res Chip: Semiconductor Resistor; DistPartNo: P1.0KGCT-ND; ManPartNo: ERJ-3GEYJ102V; Published: 8-Jun-2000; LatestRevisionDate: 17-Jul-2002; LatestRevisionNote: Re-released for DXP Platform.; PackageReference: AXIAL-0.5; Publisher: Altium Limited; PackageDescription: Axial Device, Thru-Hole; 2 Leads; 0.5 in Pin Spacing
X1 = ASE-20.000MHZ-LC-T: DistPartNo: 535-9565-1-ND; ManPartNo: ASE-20.000MHZ-LC-T

## Sheet USB_to_UART.SchDoc
size A
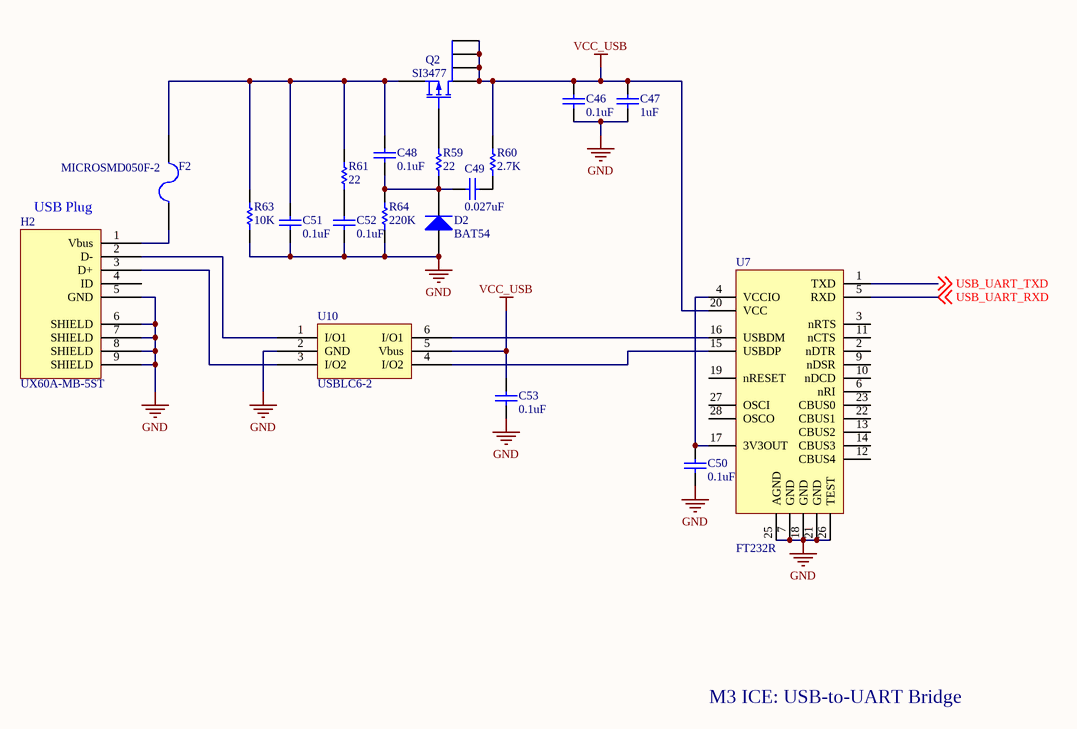
[diagram p3: USB_to_UART.SchDoc]

### Parts
C46  value 0.1uF  [1608[0603]]  (hidden comment: Cap Semi)
C47  value 1uF  [1608[0603]]  (hidden comment: Cap Semi)
C48  value 0.1uF  [1608[0603]]  (hidden comment: Cap Semi)
C49  value 0.027uF  [1608[0603]]  (hidden comment: Cap Semi)
C50  value 0.1uF  [1608[0603]]  (hidden comment: Cap Semi)
C51  value 0.1uF  [1608[0603]]  (hidden comment: Cap Semi)
C52  value 0.1uF  [1608[0603]]  (hidden comment: Cap Semi)
C53  value 0.1uF  [1608[0603]]  (hidden comment: Cap Semi)
D2  BAT54  [SOT-23_N]
F2  MICROSMD050F-2  [1210]
H2  UX60A-MB-5ST  [USB Mini-B]
Q2  SI3477  [TSOP-6]
R59  value 22  [0603]  (hidden comment: Res Chip)
R60  value 2.7K  [0603]  (hidden comment: Res Chip)
R61  value 22  [0603]  (hidden comment: Res Chip)
R63  value 10K  [0603]  (hidden comment: Res Chip)
R64  value 220K  [0603]  (hidden comment: Res Chip)
U7  FT232R  [SSOP20]
U10  USBLC6-2  [SOT23-6_L]

### Nets
GND: C46.1 C47.1 C50.1 C51.1 C52.1 C53.1 D2.1(A) H2.5(GND) H2.6(SHIELD) H2.7(SHIELD) H2.8(SHIELD) H2.9(SHIELD) R63.1 R64.1 U7.7(GND) U7.18(GND) U7.21(GND) U7.25(AGND) U7.26(TEST) U10.2(GND)
VCC_USB: C46.2 C47.2 C53.2 Q2.1(D) Q2.2(D) Q2.5(D) Q2.6(D) R60.2 U7.20(VCC) U10.5(Vbus)
USB_UART_RXD: U7.5(RXD) ; off-sheet USB_UART_RXD
USB_UART_TXD: U7.1(TXD) ; off-sheet USB_UART_TXD
NetC48_1: C48.1 C49.2 D2.3(K) R59.1 R64.2
NetC48_2: C48.2 C51.2 F2.2 Q2.4(S) R61.2 R63.2
NetC49_1: C49.1 R60.1
NetC50_2: C50.2 U7.4(VCCIO) U7.17(3V3OUT)
NetC52_2: C52.2 R61.1
NetF2_1: F2.1 H2.1(Vbus)
NetH2_2: H2.2(D-) U10.1(I/O1)
NetH2_3: H2.3(D+) U10.3(I/O2)
NetQ2_3: Q2.3(G) R59.2
NetU7_15: U7.15(USBDP) U10.4(I/O2)
NetU7_16: U7.16(USBDM) U10.6(I/O1)

Not connected (* = marked no-connect by the designer): H2 4(ID); U7 2(nDTR) 3(nRTS) 6(nRI) 9(nDSR) 10(nDCD) 11(nCTS) 12(CBUS4) 13(CBUS2) 14(CBUS3) 19(nRESET) 22(CBUS1) 23(CBUS0) 27(OSCI) 28(OSCO)

### Notes on the sheet
- (near H2) USB Plug
- M3 ICE: USB-to-UART Bridge

### Library data of the parts
C46 C48 C50-C53 = Cap Semi: Capacitor (Semiconductor SIM Model); DistPartNo: 445-1317-1-ND; ManPartNo: C1608X7R1C104K; Published: 8-Jun-2000; LatestRevisionDate: 29-May-2009; LatestRevisionNote: IPC-7351 Footprint Added.; PackageReference: C1206; Publisher: Altium Limited; PackageDescription: Chip Capacitor
C47 = Cap Semi: Capacitor (Semiconductor SIM Model); DistPartNo: 445-1327-1-ND; ManPartNo: C1608Y5V1C105Z; Published: 8-Jun-2000; LatestRevisionDate: 29-May-2009; LatestRevisionNote: IPC-7351 Footprint Added.; PackageReference: C1206; Publisher: Altium Limited; PackageDescription: Chip Capacitor
C49 = Cap Semi: Capacitor (Semiconductor SIM Model); DistPartNo: 478-1232-1-ND; ManPartNo: 06035C273KAT2A; Published: 8-Jun-2000; LatestRevisionDate: 29-May-2009; LatestRevisionNote: IPC-7351 Footprint Added.; PackageReference: C1206; Publisher: Altium Limited; PackageDescription: Chip Capacitor
D2 = Diode BAT18: Low-Loss RF Switching Diode; DistPartNo: BAT54-FDICT-ND; ManPartNo: BAT54-7-F; Note: Pin 2 is not connected and not drawn.; Published: 21-Mar-2003; LatestRevisionDate: 29-May-2009; LatestRevisionNote: IPC-7351 Footprint Added.; DatasheetVersion: Oct-1999; PackageVersion: Sep-2001; PackageReference: SOT-23; Publisher: Altium Limited; PackageDescription: 3-Pin SOT-23 Package 0.95 mm Pitch, 2.5 mm Lead Span; ComponentLink1Description: Manufacturer Link; ComponentLink1URL: http://www.infineon.com/
F2 = Fuse MICROSMD050F-2: POLYSWITCH 0.50A RESET FUSE SMD; DistPartNo: MICROSMD050FCT-ND; ManPartNo: MICROSMD050F-2
H2 = UX60-MB-5ST: USB mini-B; DistPartNo: H2961CT-ND; ManPartNo: UX60A-MB-5ST
Q2 = SI3477: P-Channel MOSFET; DistPartNo: SI3477DV-T1-GE3CT-ND; ManPartNo: SI3477DV-T1-GE3
R59 R61 = Res Chip: Semiconductor Resistor; DistPartNo: P22GCT-ND; ManPartNo: ERJ-3GEYJ220V; Published: 8-Jun-2000; LatestRevisionDate: 17-Jul-2002; LatestRevisionNote: Re-released for DXP Platform.; PackageReference: AXIAL-0.5; Publisher: Altium Limited; PackageDescription: Axial Device, Thru-Hole; 2 Leads; 0.5 in Pin Spacing
R60 = Res Chip: Semiconductor Resistor; DistPartNo: P2.7KGCT-ND; ManPartNo: ERJ-3GEYJ272V; Published: 8-Jun-2000; LatestRevisionDate: 17-Jul-2002; LatestRevisionNote: Re-released for DXP Platform.; PackageReference: AXIAL-0.5; Publisher: Altium Limited; PackageDescription: Axial Device, Thru-Hole; 2 Leads; 0.5 in Pin Spacing
R63 = Res Chip: as R65 on sheet FPGA_IO; Published: 8-Jun-2000; LatestRevisionDate: 17-Jul-2002; LatestRevisionNote: Re-released for DXP Platform.; PackageReference: AXIAL-0.5; Publisher: Altium Limited; PackageDescription: Axial Device, Thru-Hole; 2 Leads; 0.5 in Pin Spacing
R64 = Res Chip: Semiconductor Resistor; DistPartNo: P220KGCT-ND; ManPartNo: ERJ-3GEYJ224V; Published: 8-Jun-2000; LatestRevisionDate: 17-Jul-2002; LatestRevisionNote: Re-released for DXP Platform.; PackageReference: AXIAL-0.5; Publisher: Altium Limited; PackageDescription: Axial Device, Thru-Hole; 2 Leads; 0.5 in Pin Spacing
U7 = FT232R: DistPartNo: 768-1007-1-ND; ManPartNo: FT232RL-REEL
U10 = USBLC6-2: USB ESD Protection; DistPartNo: 497-11882-1-ND; ManPartNo: USBLC6-2SC6Y

## Sheet M3_Chip.SchDoc
size A
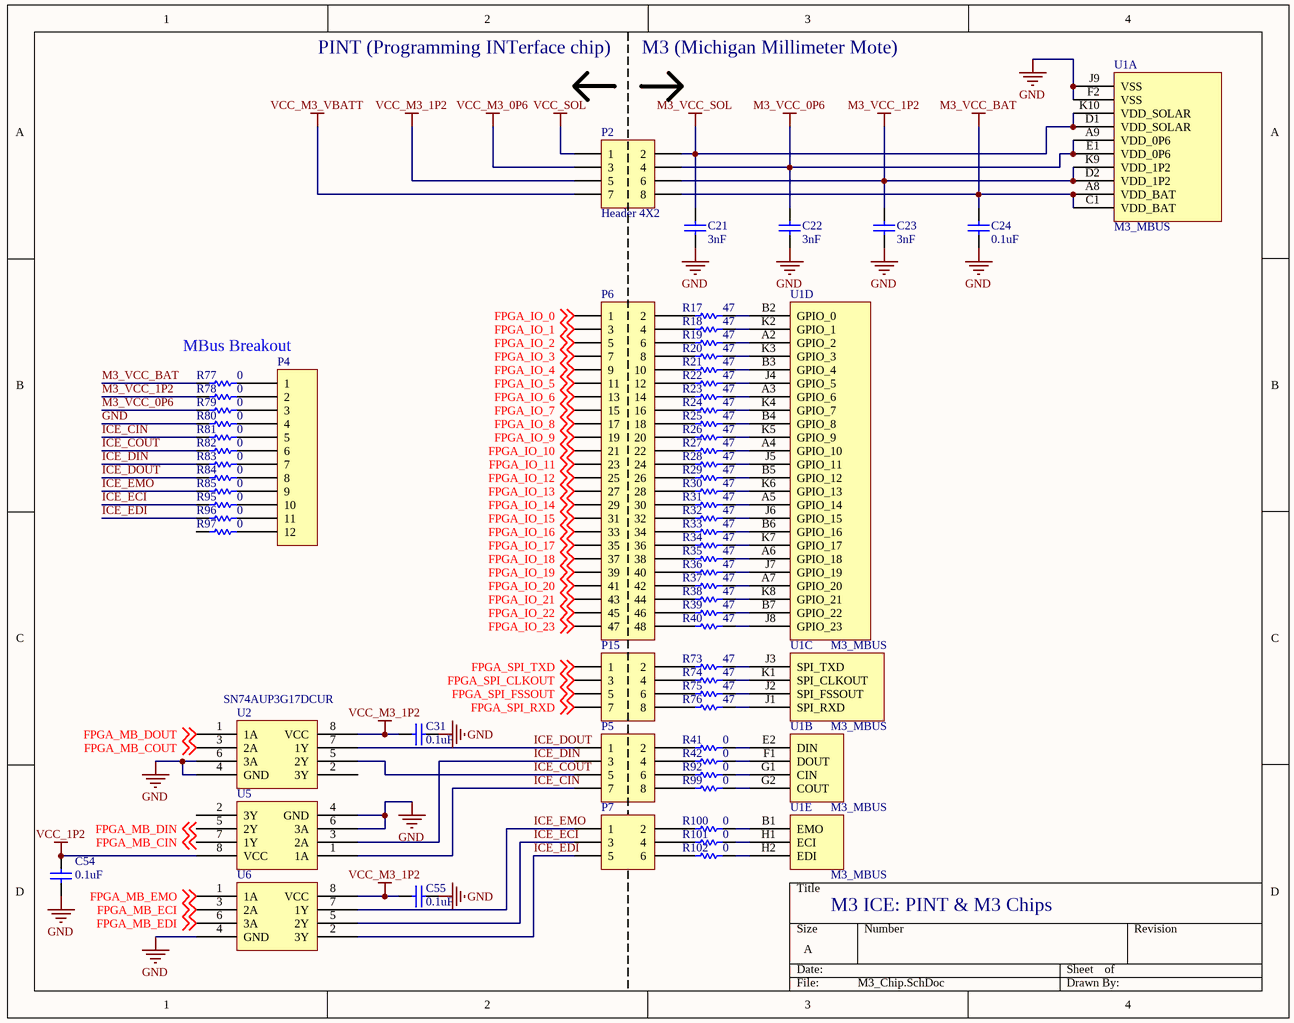
[diagram p4: M3_Chip.SchDoc]

### Parts
C21  value 3nF  [1608[0603]]  (hidden comment: Cap Semi)
C22  value 3nF  [1608[0603]]  (hidden comment: Cap Semi)
C23  value 3nF  [1608[0603]]  (hidden comment: Cap Semi)
C24  value 0.1uF  [1608[0603]]  (hidden comment: Cap Semi)
C31  value 0.1uF  [1608[0603]]  (hidden comment: Cap Semi)
C54  value 0.1uF  [1608[0603]]  (hidden comment: Cap Semi)
C55  value 0.1uF  [1608[0603]]  (hidden comment: Cap Semi)
P2  Header 4X2  [HDR2X4]
P4  MBus Breakout  [HDR1X12]  (value not drawn)
P5  Header 4X2  [HDR2X4]  (value not drawn)
P6  Header 24X2  [HDR2X24]  (value not drawn)
P7  Header 3X2  [HDR2X3]  (value not drawn)
P15  Header 4X2  [HDR2X4]  (value not drawn)
R17  value 47  [0603]  (hidden comment: Res Chip)
R18  value 47  [0603]  (hidden comment: Res Chip)
R19  value 47  [0603]  (hidden comment: Res Chip)
R20  value 47  [0603]  (hidden comment: Res Chip)
R21  value 47  [0603]  (hidden comment: Res Chip)
R22  value 47  [0603]  (hidden comment: Res Chip)
R23  value 47  [0603]  (hidden comment: Res Chip)
R24  value 47  [0603]  (hidden comment: Res Chip)
R25  value 47  [0603]  (hidden comment: Res Chip)
R26  value 47  [0603]  (hidden comment: Res Chip)
R27  value 47  [0603]  (hidden comment: Res Chip)
R28  value 47  [0603]  (hidden comment: Res Chip)
R29  value 47  [0603]  (hidden comment: Res Chip)
R30  value 47  [0603]  (hidden comment: Res Chip)
R31  value 47  [0603]  (hidden comment: Res Chip)
R32  value 47  [0603]  (hidden comment: Res Chip)
R33  value 47  [0603]  (hidden comment: Res Chip)
R34  value 47  [0603]  (hidden comment: Res Chip)
R35  value 47  [0603]  (hidden comment: Res Chip)
R36  value 47  [0603]  (hidden comment: Res Chip)
R37  value 47  [0603]  (hidden comment: Res Chip)
R38  value 47  [0603]  (hidden comment: Res Chip)
R39  value 47  [0603]  (hidden comment: Res Chip)
R40  value 47  [0603]  (hidden comment: Res Chip)
R41  value 0  [0603]  (hidden comment: Res Chip)
R42  value 0  [0603]  (hidden comment: Res Chip)
R73  value 47  [0603]  (hidden comment: Res Chip)
R74  value 47  [0603]  (hidden comment: Res Chip)
R75  value 47  [0603]  (hidden comment: Res Chip)
R76  value 47  [0603]  (hidden comment: Res Chip)
R77  value 0  [0603]  (hidden comment: Res Chip)
R78  value 0  [0603]  (hidden comment: Res Chip)
R79  value 0  [0603]  (hidden comment: Res Chip)
R80  value 0  [0603]  (hidden comment: Res Chip)
R81  value 0  [0603]  (hidden comment: Res Chip)
R82  value 0  [0603]  (hidden comment: Res Chip)
R83  value 0  [0603]  (hidden comment: Res Chip)
R84  value 0  [0603]  (hidden comment: Res Chip)
R85  value 0  [0603]  (hidden comment: Res Chip)
R92  value 0  [0603]  (hidden comment: Res Chip)
R95  value 0  [0603]  (hidden comment: Res Chip)
R96  value 0  [0603]  (hidden comment: Res Chip)
R97  value 0  [0603]  (hidden comment: Res Chip)
R99  value 0  [0603]  (hidden comment: Res Chip)
R100  value 0  [0603]  (hidden comment: Res Chip)
R101  value 0  [0603]  (hidden comment: Res Chip)
R102  value 0  [0603]  (hidden comment: Res Chip)
U1  M3_MBUS  [CPGA-65]  (parts A,B,C,D,E of 5)
U2  SN74AUP3G17DCUR  [VFSOP-8]
U5  SN74AUP3G17DCUR  [VFSOP-8]  (value not drawn)
U6  SN74AUP3G17DCUR  [VFSOP-8]  (value not drawn)

### Nets
GND: C21.1 C22.1 C23.1 C24.1 C31.1 C54.1 C55.1 R80.2 U1.F2(VSS) U1.J9(VSS) U2.4(GND) U2.6(3A) U5.4(GND) U5.6(3A) U6.4(GND)
M3_VCC_0P6: C22.2 P2.4 R79.2 U1.A9(VDD_0P6) U1.E1(VDD_0P6)
M3_VCC_1P2: C23.2 P2.6 R78.2 U1.D2(VDD_1P2) U1.K9(VDD_1P2)
M3_VCC_BAT: C24.2 P2.8 R77.2 U1.A8(VDD_BAT) U1.C1(VDD_BAT)
M3_VCC_SOL: C21.2 P2.2 U1.D1(VDD_SOLAR) U1.K10(VDD_SOLAR)
VCC_1P2: C54.2 U5.8(VCC)
VCC_M3_0P6: P2.3
VCC_M3_1P2: C31.2 C55.2 P2.5 U2.8(VCC) U6.8(VCC)
VCC_M3_VBATT: P2.7
VCC_SOL: P2.1
FPGA_IO_0: P6.1 ; off-sheet FPGA_IO_0
FPGA_IO_1: P6.3 ; off-sheet FPGA_IO_1
FPGA_IO_2: P6.5 ; off-sheet FPGA_IO_2
FPGA_IO_3: P6.7 ; off-sheet FPGA_IO_3
FPGA_IO_4: P6.9 ; off-sheet FPGA_IO_4
FPGA_IO_5: P6.11 ; off-sheet FPGA_IO_5
FPGA_IO_6: P6.13 ; off-sheet FPGA_IO_6
FPGA_IO_7: P6.15 ; off-sheet FPGA_IO_7
FPGA_IO_8: P6.17 ; off-sheet FPGA_IO_8
FPGA_IO_9: P6.19 ; off-sheet FPGA_IO_9
FPGA_IO_10: P6.21 ; off-sheet FPGA_IO_10
FPGA_IO_11: P6.23 ; off-sheet FPGA_IO_11
FPGA_IO_12: P6.25 ; off-sheet FPGA_IO_12
FPGA_IO_13: P6.27 ; off-sheet FPGA_IO_13
FPGA_IO_14: P6.29 ; off-sheet FPGA_IO_14
FPGA_IO_15: P6.31 ; off-sheet FPGA_IO_15
FPGA_IO_16: P6.33 ; off-sheet FPGA_IO_16
FPGA_IO_17: P6.35 ; off-sheet FPGA_IO_17
FPGA_IO_18: P6.37 ; off-sheet FPGA_IO_18
FPGA_IO_19: P6.39 ; off-sheet FPGA_IO_19
FPGA_IO_20: P6.41 ; off-sheet FPGA_IO_20
FPGA_IO_21: P6.43 ; off-sheet FPGA_IO_21
FPGA_IO_22: P6.45 ; off-sheet FPGA_IO_22
FPGA_IO_23: P6.47 ; off-sheet FPGA_IO_23
FPGA_MB_CIN: U5.7(1Y) ; off-sheet FPGA_MB_CIN
FPGA_MB_COUT: U2.3(2A) ; off-sheet FPGA_MB_COUT
FPGA_MB_DIN: U5.5(2Y) ; off-sheet FPGA_MB_DIN
FPGA_MB_DOUT: U2.1(1A) ; off-sheet FPGA_MB_DOUT
FPGA_MB_ECI: U6.3(2A) ; off-sheet FPGA_MB_ECI
FPGA_MB_EDI: U6.6(3A) ; off-sheet FPGA_MB_EDI
FPGA_MB_EMO: U6.1(1A) ; off-sheet FPGA_MB_EMO
FPGA_SPI_CLKOUT: P15.3 ; off-sheet FPGA_SPI_CLKOUT
FPGA_SPI_FSSOUT: P15.5 ; off-sheet FPGA_SPI_FSSOUT
FPGA_SPI_RXD: P15.7 ; off-sheet FPGA_SPI_RXD
FPGA_SPI_TXD: P15.1 ; off-sheet FPGA_SPI_TXD
ICE_CIN: P5.7 R81.2 U5.1(1A)
ICE_COUT: P5.5 R82.2 U2.5(2Y)
ICE_DIN: P5.3 R83.2 U5.3(2A)
ICE_DOUT: P5.1 R84.2 U2.7(1Y)
ICE_ECI: P7.3 R95.2 U6.5(2Y)
ICE_EDI: P7.5 R96.2 U6.2(3Y)
ICE_EMO: P7.1 R85.2 U6.7(1Y)
NetP4_1: P4.1 R77.1
NetP4_2: P4.2 R78.1
NetP4_3: P4.3 R79.1
NetP4_4: P4.4 R80.1
NetP4_5: P4.5 R81.1
NetP4_6: P4.6 R82.1
NetP4_7: P4.7 R83.1
NetP4_8: P4.8 R84.1
NetP4_9: P4.9 R85.1
NetP4_10: P4.10 R95.1
NetP4_11: P4.11 R96.1
NetP4_12: P4.12 R97.1
NetP5_2: P5.2 R41.2
NetP5_4: P5.4 R42.2
NetP5_6: P5.6 R92.2
NetP5_8: P5.8 R99.2
NetP6_2: P6.2 R17.2
NetP6_4: P6.4 R18.2
NetP6_6: P6.6 R19.2
NetP6_8: P6.8 R20.2
NetP6_10: P6.10 R21.2
NetP6_12: P6.12 R22.2
NetP6_14: P6.14 R23.2
NetP6_16: P6.16 R24.2
NetP6_18: P6.18 R25.2
NetP6_20: P6.20 R26.2
NetP6_22: P6.22 R27.2
NetP6_24: P6.24 R28.2
NetP6_26: P6.26 R29.2
NetP6_28: P6.28 R30.2
NetP6_30: P6.30 R31.2
NetP6_32: P6.32 R32.2
NetP6_34: P6.34 R33.2
NetP6_36: P6.36 R34.2
NetP6_38: P6.38 R35.2
NetP6_40: P6.40 R36.2
NetP6_42: P6.42 R37.2
NetP6_44: P6.44 R38.2
NetP6_46: P6.46 R39.2
NetP6_48: P6.48 R40.2
NetP7_2: P7.2 R100.2
NetP7_4: P7.4 R101.2
NetP7_6: P7.6 R102.2
NetP15_2: P15.2 R73.2
NetP15_4: P15.4 R74.2
NetP15_6: P15.6 R75.2
NetP15_8: P15.8 R76.2
NetR17_1: R17.1 U1.B2(GPIO_0)
NetR18_1: R18.1 U1.K2(GPIO_1)
NetR19_1: R19.1 U1.A2(GPIO_2)
NetR20_1: R20.1 U1.K3(GPIO_3)
NetR21_1: R21.1 U1.B3(GPIO_4)
NetR22_1: R22.1 U1.J4(GPIO_5)
NetR23_1: R23.1 U1.A3(GPIO_6)
NetR24_1: R24.1 U1.K4(GPIO_7)
NetR25_1: R25.1 U1.B4(GPIO_8)
NetR26_1: R26.1 U1.K5(GPIO_9)
NetR27_1: R27.1 U1.A4(GPIO_10)
NetR28_1: R28.1 U1.J5(GPIO_11)
NetR29_1: R29.1 U1.B5(GPIO_12)
NetR30_1: R30.1 U1.K6(GPIO_13)
NetR31_1: R31.1 U1.A5(GPIO_14)
NetR32_1: R32.1 U1.J6(GPIO_15)
NetR33_1: R33.1 U1.B6(GPIO_16)
NetR34_1: R34.1 U1.K7(GPIO_17)
NetR35_1: R35.1 U1.A6(GPIO_18)
NetR36_1: R36.1 U1.J7(GPIO_19)
NetR37_1: R37.1 U1.A7(GPIO_20)
NetR38_1: R38.1 U1.K8(GPIO_21)
NetR39_1: R39.1 U1.B7(GPIO_22)
NetR40_1: R40.1 U1.J8(GPIO_23)
NetR41_1: R41.1 U1.E2(DIN)
NetR42_1: R42.1 U1.F1(DOUT)
NetR73_1: R73.1 U1.J3(SPI_TXD)
NetR74_1: R74.1 U1.K1(SPI_CLKOUT)
NetR75_1: R75.1 U1.J2(SPI_FSSOUT)
NetR76_1: R76.1 U1.J1(SPI_RXD)
NetR92_1: R92.1 U1.G1(CIN)
NetR99_1: R99.1 U1.G2(COUT)
NetR100_1: R100.1 U1.B1(EMO)
NetR101_1: R101.1 U1.H1(ECI)
NetR102_1: R102.1 U1.H2(EDI)

Not connected (* = marked no-connect by the designer): R97 2; U2 2(3Y); U5 2(3Y)

### Notes on the sheet
- PINT (Programming INTerface chip)
- M3 (Michigan Millimeter Mote)
- MBus Breakout
- M3 ICE: PINT & M3 Chips

### Library data of the parts
C21-C23 = Cap Semi: Capacitor (Semiconductor SIM Model); DistPartNo: 399-7893-1-ND; ManPartNo: C0603C302K5GACTU; Published: 8-Jun-2000; LatestRevisionDate: 29-May-2009; LatestRevisionNote: IPC-7351 Footprint Added.; PackageReference: C1206; Publisher: Altium Limited; PackageDescription: Chip Capacitor
C24 C31 C54 C55 = Cap Semi: as C46 on sheet USB_to_UART; Published: 8-Jun-2000; LatestRevisionDate: 29-May-2009; LatestRevisionNote: IPC-7351 Footprint Added.; PackageReference: C1206; Publisher: Altium Limited; PackageDescription: Chip Capacitor
P2 P5 P15 = Header 4X2: Header, 4-Pin, Dual row; LatestRevisionDate: 17-Jul-2002; LatestRevisionNote: Re-released for DXP Platform.; Publisher: Altium Limited
P4 = Header 12: Header, 12-Pin; LatestRevisionDate: 17-Jul-2002; LatestRevisionNote: Re-released for DXP Platform.; Publisher: Altium Limited
P6 = Header 24X2: Header, 24-Pin, Dual row; ManPartNo: 4-103328-0; LatestRevisionDate: 17-Jul-2002; LatestRevisionNote: Re-released for DXP Platform.; Publisher: Altium Limited
P7 = Header 3X2: Header, 3-Pin, Dual row; LatestRevisionDate: 17-Jul-2002; LatestRevisionNote: Re-released for DXP Platform.; Publisher: Altium Limited
R17-R40 R73-R76 = Res Chip: Semiconductor Resistor; DistPartNo: P47GCT-ND; ManPartNo: ERJ-3GEYJ470V; Published: 8-Jun-2000; LatestRevisionDate: 17-Jul-2002; LatestRevisionNote: Re-released for DXP Platform.; PackageReference: AXIAL-0.5; Publisher: Altium Limited; PackageDescription: Axial Device, Thru-Hole; 2 Leads; 0.5 in Pin Spacing
R41 R42 R77-R85 R92 R95-R97 R99-R102 = Res Chip: as R1 on sheet Power; Published: 8-Jun-2000; LatestRevisionDate: 17-Jul-2002; LatestRevisionNote: Re-released for DXP Platform.; PackageReference: AXIAL-0.5; Publisher: Altium Limited; PackageDescription: Axial Device, Thru-Hole; 2 Leads; 0.5 in Pin Spacing
U1 = M3_MBUS: DistPartNo: 3M5067-ND; ManPartNo: 200-6311-9UN-1900
U2 U5 U6 = SN74AUP3G17DCUR: DistPartNo: 296-25596-1-ND; ManPartNo: SN74AUP3G17DCUR

## Nets that join several sheets
GND: FPGA_IO (17 pins), Power (47 pins), FPGA_misc (36 pins), USB_to_UART (20 pins), M3_Chip (15 pins)
VCC_1P2: FPGA_IO (P12.2 R9.2), Power (C26.2 P16.1 TP18.1), FPGA_misc (21 pins), M3_Chip (C54.2 U5.8)
VCC_B0: FPGA_IO (9 pins), Power (7 pins), FPGA_misc (14 pins)
VCC_GOC: FPGA_IO (C61.1 R12.1 U3.4), Power (5 pins)
VCC_M3_0P6: Power (S7.3 TP21.1), M3_Chip (P2.3)
VCC_M3_1P2: Power (S5.3 TP16.1), M3_Chip (5 pins)
VCC_M3_VBATT: Power (S6.3 TP14.1), M3_Chip (P2.7)
VCC_PRE: FPGA_IO (P12.6), Power (24 pins)
VCC_SOL: Power (TP27.1), M3_Chip (P2.1)
VCC_USB: Power (P8.2 TP19.1), USB_to_UART (10 pins)
FPGA_IO_0: FPGA_IO (F1.63), M3_Chip (P6.1)
FPGA_IO_1: FPGA_IO (F1.62), M3_Chip (P6.3)
FPGA_IO_2: FPGA_IO (F1.61), M3_Chip (P6.5)
FPGA_IO_3: FPGA_IO (F1.60), M3_Chip (P6.7)
FPGA_IO_4: FPGA_IO (F1.59), M3_Chip (P6.9)
FPGA_IO_5: FPGA_IO (F1.58), M3_Chip (P6.11)
FPGA_IO_6: FPGA_IO (F1.57), M3_Chip (P6.13)
FPGA_IO_7: FPGA_IO (F1.45), M3_Chip (P6.15)
FPGA_IO_8: FPGA_IO (F1.44), M3_Chip (P6.17)
FPGA_IO_9: FPGA_IO (F1.43), M3_Chip (P6.19)
FPGA_IO_10: FPGA_IO (F1.42), M3_Chip (P6.21)
FPGA_IO_11: FPGA_IO (F1.41), M3_Chip (P6.23)
FPGA_IO_12: FPGA_IO (F1.40), M3_Chip (P6.25)
FPGA_IO_13: FPGA_IO (F1.36), M3_Chip (P6.27)
FPGA_IO_14: FPGA_IO (F1.35), M3_Chip (P6.29)
FPGA_IO_15: FPGA_IO (F1.34), M3_Chip (P6.31)
FPGA_IO_16: FPGA_IO (F1.33), M3_Chip (P6.33)
FPGA_IO_17: FPGA_IO (F1.32), M3_Chip (P6.35)
FPGA_IO_18: FPGA_IO (F1.31), M3_Chip (P6.37)
FPGA_IO_19: FPGA_IO (F1.30), M3_Chip (P6.39)
FPGA_IO_20: FPGA_IO (F1.29), M3_Chip (P6.41)
FPGA_IO_21: FPGA_IO (F1.28), M3_Chip (P6.43)
FPGA_IO_22: FPGA_IO (F1.27), M3_Chip (P6.45)
FPGA_IO_23: FPGA_IO (F1.26), M3_Chip (P6.47)
FPGA_MB_CIN: FPGA_IO (F1.70), M3_Chip (U5.7)
FPGA_MB_COUT: FPGA_IO (F1.72), M3_Chip (U2.3)
FPGA_MB_DIN: FPGA_IO (F1.71), M3_Chip (U5.5)
FPGA_MB_DOUT: FPGA_IO (F1.73), M3_Chip (U2.1)
FPGA_MB_ECI: FPGA_IO (F1.64), M3_Chip (U6.3)
FPGA_MB_EDI: FPGA_IO (F1.69), M3_Chip (U6.6)
FPGA_MB_EMO: FPGA_IO (F1.65), M3_Chip (U6.1)
M3_0P6_SW: FPGA_IO (F1.98), Power (U18.4)
M3_1P2_SW: FPGA_IO (F1.97), Power (U8.4)
M3_VBATT_SW: FPGA_IO (F1.96), Power (U17.4)
PMU_SCL: FPGA_IO (F1.95), Power (R58.1 U4.30)
PMU_SDA: FPGA_IO (F1.94), Power (R86.1 U4.31)
SYS_CLK: FPGA_IO (F1.93), FPGA_misc (TP1.1 X1.3)
USB_UART_RXD: FPGA_IO (F1.92), USB_to_UART (U7.5)
USB_UART_TXD: FPGA_IO (F1.91), USB_to_UART (U7.1)